# EasyEDA Pro project ProProject_my_heart_2023-08-05.epro

# Schematic Schematic1
Create Date: 2023-07-27; Page Name: P1; Project Name: my_heart; Schematic Name: Schematic1; Update Date: 2023-07-29; Company: 嘉立创EDA; Page Size: A3; Version: V1.0
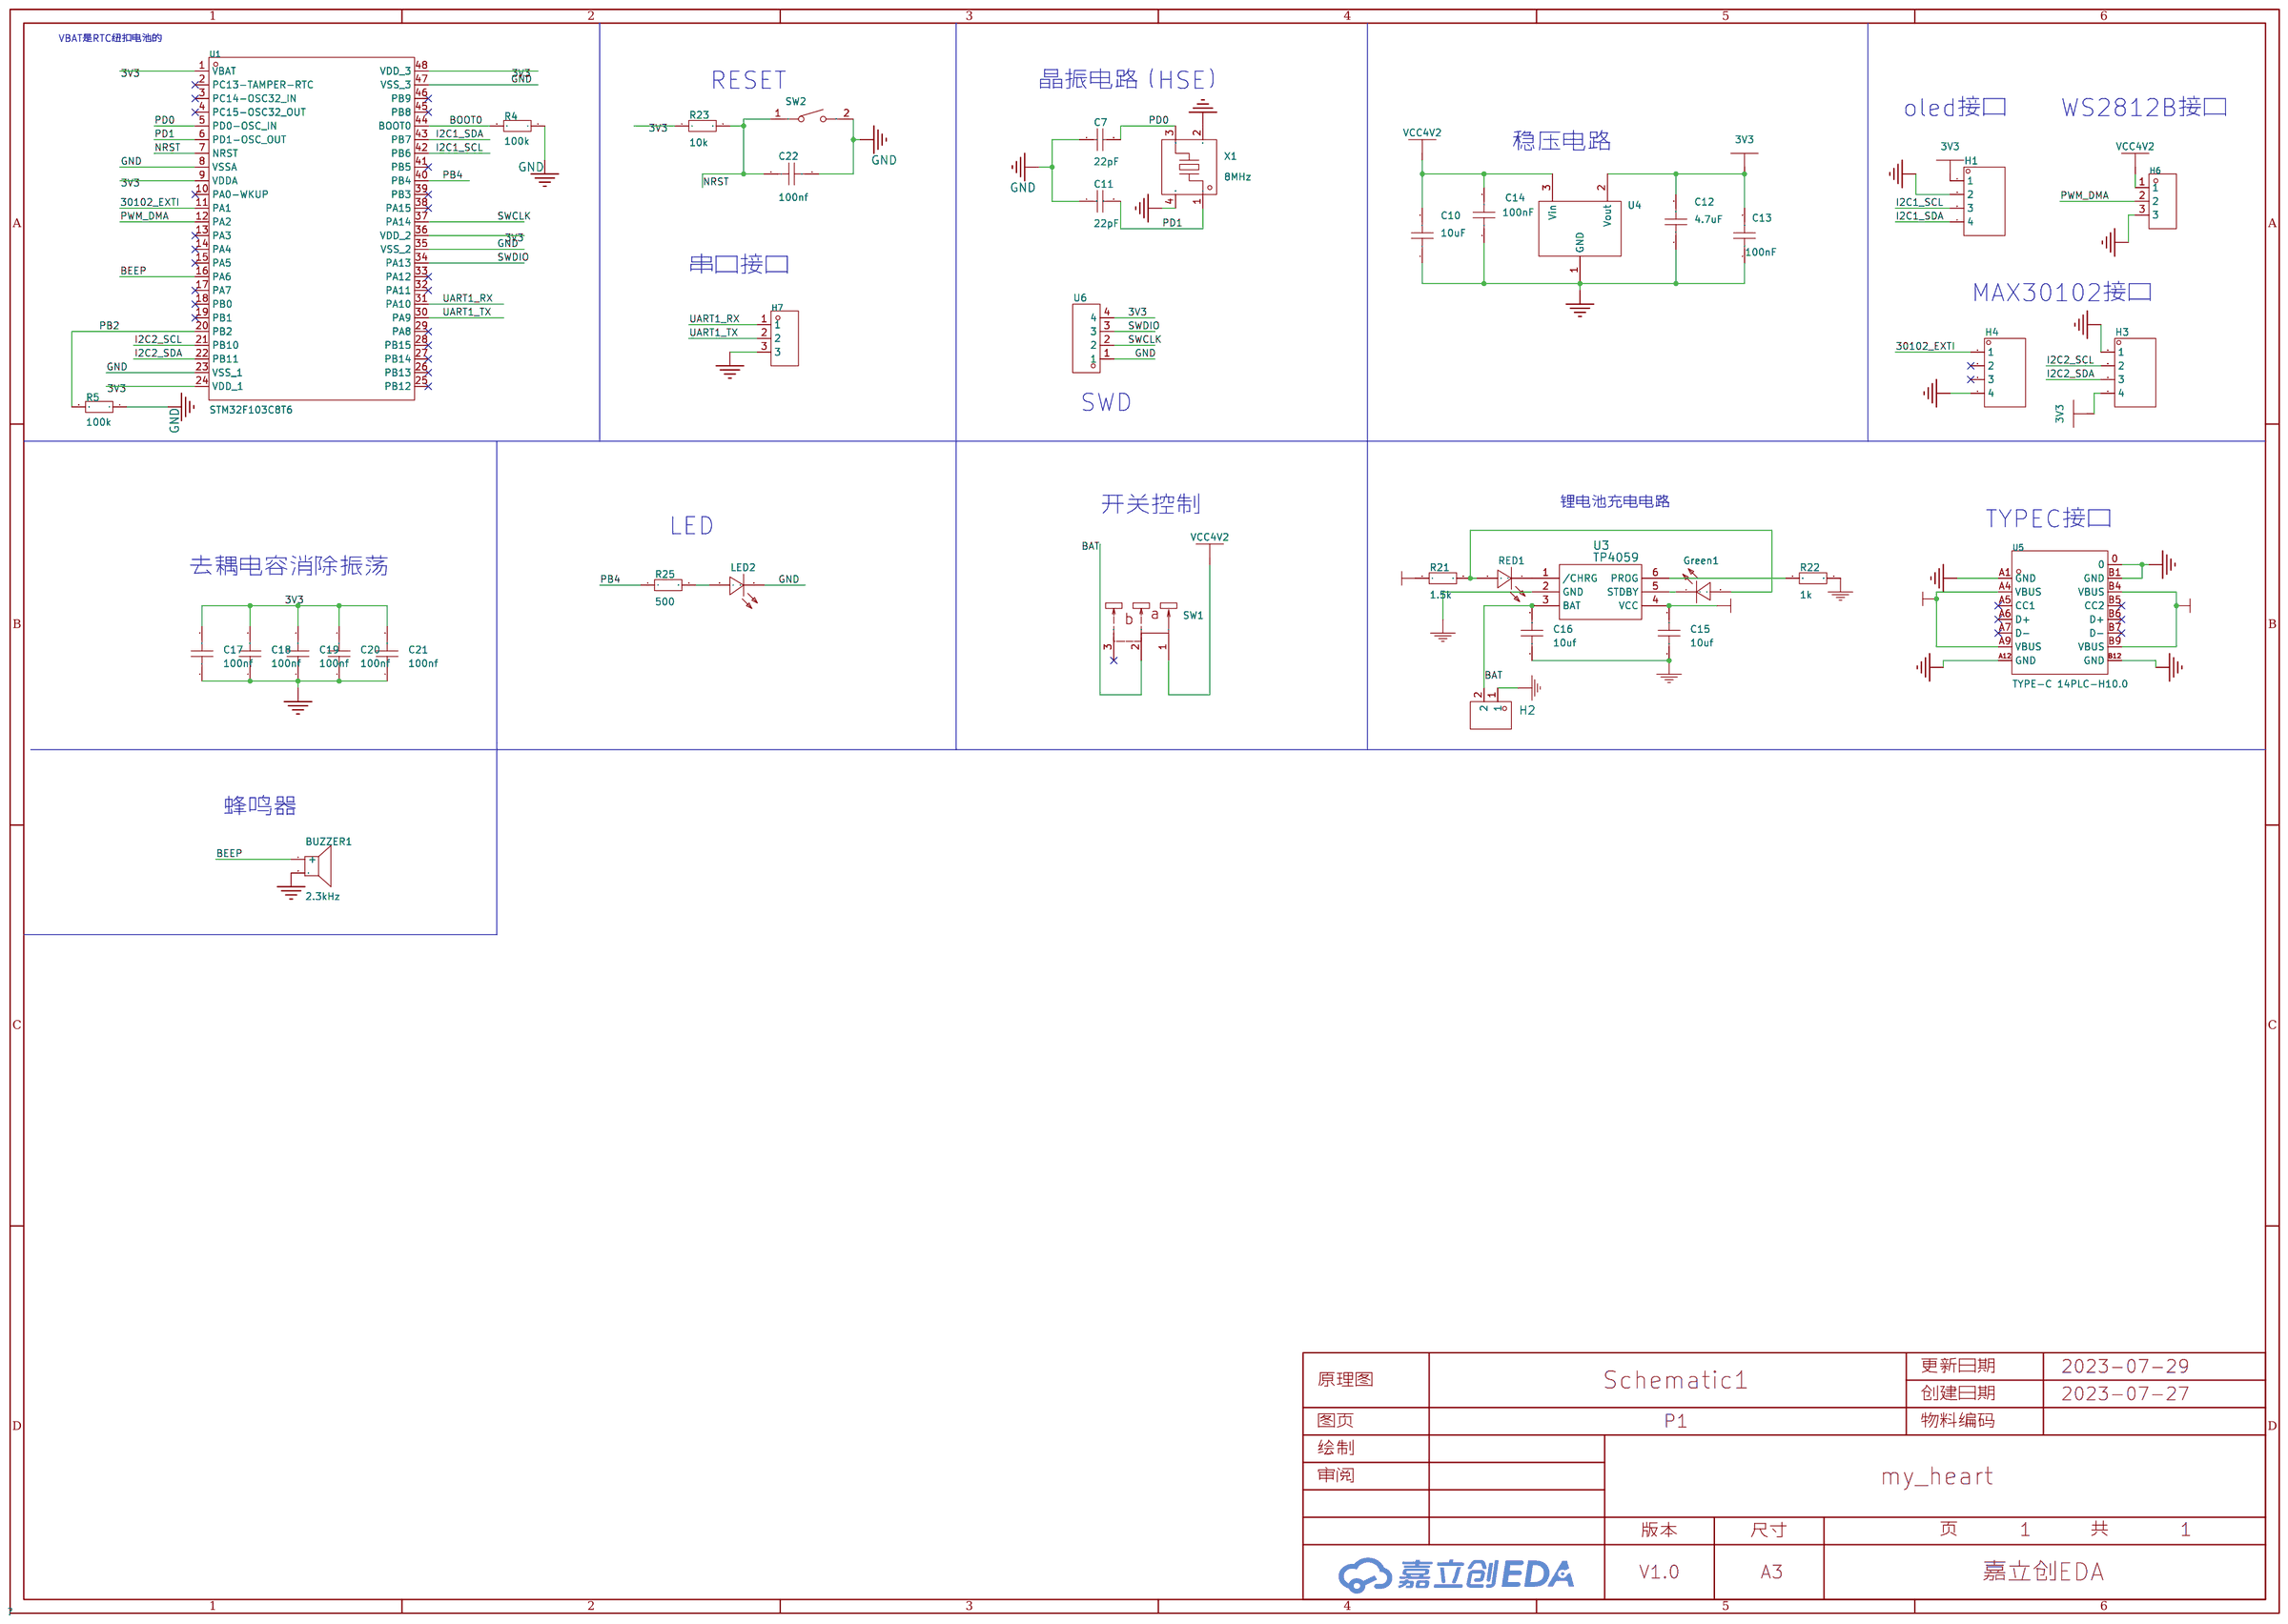
[diagram p0: schematic sheet]

## Parts
BUZZER1  2.3kHz  [BUZ-TH_BD12.0-P7.60-D0.6-FD]
C7  22pF  [C0805]
C10  10uF  [c0805]
C11  22pF  [C0805]
C12  4.7uF  [c0805]
C13  100nF  [c0805]
C14  100nF  [c0805]
C15  100nF  [C0603]
C16  100nF  [C0603]
C17  100nF  [C0603]
C18  100nF  [C0603]
C19  100nF  [C0603]
C20  100nF  [C0603]
C21  100nF  [C0603]
C22  100nF  [C0603]
Green1  KT-0603R  [LED0603-RD]
H1  -  [HDR-TH_4P-P2.54-V-M_1]
H2  MF254V-11-02-0743  [HDR-TH_2P-P2.00-V-M]
H3  -  [HDR-TH_4P-P2.54-V-M_1]
H4  -  [HDR-TH_4P-P2.54-V-M_1]
H6  -  [HDR-TH_3P-P2.54-V-F]
H7  -  [HDR-TH_3P-P2.54-V-F]
LED2  KT-0603R  [LED0603-RD]
R4  100k  [r0805]
R5  100k  [r0805]
R21  10K  [R0603]
R22  10K  [R0603]
R23  10K  [R0603]
R25  10K  [R0603]
RED1  KT-0603R  [LED0603-RD]
SW1  -  [SW-TH_K3-1260D-K1]
SW2  TS-1088-AR02016  [SW-SMD_L3.9-W3.0-P4.45]
U1  STM32F103C8T6  [LQFP-48_L7.0-W7.0-P0.50-LS9.0-BL]
U3  TP4059  [SOT-23-6_L2.9-W1.6-P0.95-LS2.8-BR]
U4  -  [SOT-89-3_L4.5-W2.5-P1.50-LS4.2-BR]
U5  TYPE-C 14PLC-H10.0  [USB-C-TH_SHOUHAN_TYPE-C-14PLC-H10.0]
U6  -  [HDR-TH_4P-P2.54-V-M-3]
X1  8MHz  [OSC-SMD_4P-L3.2-W2.5-BL]

## Library data of the parts
BUZZER1 = TMB12A05_C96093: 驱动方式:有源(内含驱动线路);构造类型:电磁式;额定电压:5V;频率:2.3kHz;声压(SPL):85dB@5V,10cm;; LCSC Part Name: TMB12A05; Supplier Part: C96093; Manufacturer: 华能; Manufacturer Part: TMB12A05; Supplier Footprint: 插件,D=12mm; JLCPCB Part Class: 扩展库; Datasheet: https://atta.szlcsc.com/upload/public/pdf/source/20170522/1495448324811.pdf; Supplier: LCSC; Oscillator Circuit: 有源(内含驱动线路); Technology Type: 电磁式; Rated Voltage: 5V; Operating Voltage: 4V~8V; Sound Pressure Level (SPL): 85dB@5V,10cm; Diameter (φD): 12mm; Height: 9.8mm
C7 C11 = CC0805JRNPO9BN220: 容值:22pF;精度:±5%;额定电压:50V;温度系数:NP0;; LCSC Part Name: 22pF ±5% 50V; Supplier Part: C105623; Manufacturer: YAGEO(国巨); Supplier Footprint: 0805; JLCPCB Part Class: Extended Part; Datasheet: https://atta.szlcsc.com/upload/public/pdf/source/20170425/1493115772948.pdf; Supplier: LCSC; Tolerance: ±5%; Voltage Rated: 50V; Temperature Coefficient: NP0
C10 = CL21B106KOQNNNE: 容值:10uF;精度:±10%;额定电压:16V;温度系数:X7R;; LCSC Part Name: 10uF ±10% 16V; Supplier Part: C95841; Manufacturer: SAMSUNG(三星); Supplier Footprint: 0805; JLCPCB Part Class: Extended Part; Datasheet: https://atta.szlcsc.com/upload/public/pdf/source/20170228/1488267683307.pdf; Supplier: LCSC; Tolerance: ±10%; Voltage Rated: 16V; Temperature Coefficient: X7R
C12 = CC0805KKX5R8BB475: 容值:4.7uF;精度:±10%;额定电压:25V;温度系数:X5R;; LCSC Part Name: 4.7uF ±10% 25V; Supplier Part: C132173; Manufacturer: YAGEO(国巨); Supplier Footprint: 0805; JLCPCB Part Class: Extended Part; Datasheet: https://atta.szlcsc.com/upload/public/pdf/source/20180820/C132173_6FEE718E05F4F70062189A38690F3008.pdf; Supplier: LCSC; Tolerance: ±10%; Voltage Rated: 25V; Temperature Coefficient: X5R
C13 C14 = TCC0805X7R104K250DTS: 容值:100nF;精度:±10%;额定电压:25V;温度系数:X7R;; LCSC Part Name: 100nF ±10% 25V; Supplier Part: C376923; Manufacturer: CCTC(三环); Supplier Footprint: 0805; JLCPCB Part Class: Extended Part; Datasheet: https://atta.szlcsc.com/upload/public/pdf/source/20190418/C376923_132AE681988A7150F2DFEA56798C5038.pdf; Supplier: LCSC; Tolerance: ±10%; Voltage Rated: 25V; Temperature Coefficient: X7R
C15-C22 = CAP_0603: Supplier Footprint: 0603
Green1 LED2 RED1 = KT-0603R: 发光颜色:红灯;二极管配置:-;透镜颜色:-;主波长:-;色温:-;功率:-;发光角度:-;安装方式:-;工作温度:-40℃~+85℃;; LCSC Part Name: 0603 红灯 高亮; Supplier Part: C2286; Manufacturer: KENTO; Supplier Footprint: 0603; JLCPCB Part Class: 基础库; Datasheet: https://atta.szlcsc.com/upload/public/pdf/source/20160616/1466072038404.pdf; Supplier: LCSC; Emitted Color: 红灯; Operating Temperature: -40℃~+85℃
H1 H3 H4 = B-2100S04P-A110: 间距:2.54mm;总PIN位数:4;排数:1;插针结构:1x4P;行距:-;安装类型:直插;圆针/方针:-;额定电流:-;额定电压:-;配合针长度:6mm;塑高:2.54mm;端接针长度:3mm;触头材质:黄铜;触头镀层:-;工作温度范围:-40~+105;颜色:黑色;; LCSC Part Name: 2.54mm 1x4P; Supplier Part: C124378; Manufacturer: Ckmtw(灿科盟); Supplier Footprint: 插件,P=2.54mm; JLCPCB Part Class: Extended Part; Datasheet: https://atta.szlcsc.com/upload/public/pdf/source/20170821/C124378_1503303307508901532.pdf; Supplier: LCSC; Pitch: 2.54mm; Number of Pins: 4; Number of Rows: 1; Pin Structure: 1x4P; Mounting Type: 直插; Length of Mating Pin: 6mm; Insulation Height: 2.54mm; Length of End Connection Pin: 3mm; Contact Material: 黄铜; Operating Temperature Range: -40~+105; Color: 黑色
H2 = MF254V-11-02-0743: Supplier: LCSC; Supplier Part: C2889984; Manufacturer: XFCN(台湾兴飞)
H6 H7 = HDR-F_2.54_1x3P: Supplier Part: C541850; Supplier Footprint: 插件
R4 R5 = RC-01W1002FT: 阻值:10k;精度:±1%;功率:50mW;温度系数:±200ppm/;最大工作电压:25V;工作温度范围:-55~+125;; LCSC Part Name: 10k ±1%; Supplier Part: C304501; Manufacturer: FH(风华); Supplier Footprint: 0201; JLCPCB Part Class: Extended Part; Datasheet: https://atta.szlcsc.com/upload/public/pdf/source/20181030/C304501_FF38550671994E5E8FB5233A4E4A9820.pdf; Supplier: LCSC; Tolerance: ±1%; Power(Watts): 50mW; Temperature Coefficient: ±200ppm/; Overload Voltage (Max): 25V; Operating Temperature Range: -55~+125
R21-R23 R25 = Res_0603: Supplier Footprint: 0603
SW1 = K3-1260D-K1: 额定电流(DC):300mA;额定电压(DC):6V;额定电流(AC):-;额定电压(AC):-;电路结构:单刀双掷;安装方式:卧插;机械寿命:10000;开关颜色:黑色;滑钮形状:矩形柱状;引脚样式:PC引脚;工作温度:-25~+80;开关长度:9mm;开关宽度:3.5mm;开关高度:3.5mm;; Supplier Part: C223844; Manufacturer: 韩国韩荣; Supplier Footprint: 插件; JLCPCB Part Class: Extended Part; Datasheet: https://atta.szlcsc.com/upload/public/pdf/source/20210810/7351E43B93A35FB9B10B4EA1B1334DD2.pdf; Supplier: LCSC; Current Rating (DC): 300mA; Voltage Rating (DC): 6V; Circuit: 单刀双掷; Mounting Style: 卧插; Mechanical Life: 10000; Actuator Color: 黑色; Actuator Style: 矩形柱状; Pin Style: PC引脚; Operating Temperature: -25~+80; Switch Length: 9mm; Switch Width: 3.5mm; Switch Height: 3.5mm
SW2 = TS-1088-AR02016: 触点电流:50mA;额定电压(DC):12V;绝缘电阻:100MΩ;电路结构:单刀单掷;安装方式:立贴;作用力:160gf@±50gf;机械寿命:10万次;带支架:否;; LCSC Part Name: 4*3*2mm 立贴 轻触开关; Supplier Part: C720477; Manufacturer: XUNPU(讯普); Supplier Footprint: SMD; JLCPCB Part Class: 扩展库; Datasheet: https://atta.szlcsc.com/upload/public/pdf/source/20200810/C720475_60D09DD6C54279ADDB2DC25100F1CC11.pdf; Supplier: LCSC; Contact Current: 50mA; Voltage Rating (DC): 12V; Insulation Resistance: 100MΩ; Circuit: 单刀单掷; Mounting Style: 立贴; Actuator Style: 圆形按钮; Actuator/Cap Color: 黑色; Operating Force: 160gf@±50gf; Mechanical Life: 10万次; Operating Temperature: -30℃~+80℃; Pin Style: SMD接片; Switch Length: 4mm; Switch Width: 3mm; Switch Height: 2mm; Strike Gundam: 否
U1 = STM32F103C8T6: CPU内核:ARM Cortex-M3;CPU最大主频:72MHz;工作电压范围:2V~3.6V;内部振荡器:有;程序 FLASH容量:64K@x8bit;RAM总容量:20KB;EEPROM/数据 FLASH容量:-;GPIO端口数量:37;ADC(单元数/通道数/位数):1@x10ch/12bit;外设/功能/协议栈:看门狗；DMA；看门狗；片载温度传感器;工作温度范围:-40℃~+85℃;; LCSC Part Name: ARM Cortex-M3 72MHz 闪存：64K@x8bit RAM：20KB MSL=3; Supplier Part: C8734; Manufacturer: ST(意法半导体); Supplier Footprint: LQFP-48(7x7); JLCPCB Part Class: 基础库; Supplier: LCSC; CPU Core: ARM Cortex-M3; Maximum Frequency: 72MHz; Supply Voltage Range: 2V~3.6V; Internal Oscillator: 有; Program FLASH Size: 64K@x8bit; RAM Size: 20KB; GPIO Ports Number: 37; ADC (Units/Channels/bits): 1@x10ch/12bit; Peripherals / Functions / Protocol Stacks: 看门狗；DMA；看门狗；片载温度传感器; Operating Temperature Range: -40℃~+85℃
U3 = TP4059: Supplier: LCSC; Manufacturer: TOPPOWER; Supplier Part: C80364; JLCPCB Part Class: Extended Part
U4 = CJA1117B-3.3: 输出类型:固定;输出极性:正;输出通道数:1;最大输入电压:15V;输出电压:3.3V;压差:1.3V@(1A);输出电流:1A;电源纹波抑制比(PRSS):75dB@(120Hz);; LCSC Part Name: Vin=15V Vout=3.3V 1A 75dB@(120Hz); Supplier Part: C24253; Manufacturer: CJ（江苏长电/长晶）; Supplier Footprint: SOT-89(SOT-89-3); JLCPCB Part Class: Extended Part; Datasheet: https://atta.szlcsc.com/upload/public/pdf/source/20180420/C24253_F213F71107BF9C399B1291ED7BD22659.pdf; Supplier: LCSC; Output Type: 固定; Output Polarity: 正; Number of Outputs: 1; Maximum Input Voltage: 15V; Output Voltage: 3.3V; Dropout Voltage: 1.3V@(1A); Output Current: 1A; Power Supply Rejection Ratio (PRSS): 75dB@(120Hz)
U5 = TYPE-C 14PLC-H10.0: 连接器类型:Type-C;标准:-;公母:母座;触点数量:14P;端口数量:1;安装方式:立插;额定电流 - 电源:5A;触头材质:-;触头镀层:-;工作温度范围:-40℃~+85℃;; LCSC Part Name: Type-C 母座 立插; Supplier Part: C3151746; Manufacturer: SHOU HAN(首韩); Supplier Footprint: 插件; JLCPCB Part Class: 扩展库; Datasheet: https://atta.szlcsc.com/upload/public/pdf/source/20220627/CFB3153B5198106DD3F3B6B367CF40F3.pdf; Supplier: LCSC; Connector Type: Type-C; Gender: 母座; Number of Contacts: 14P; Number of Ports: 1; Mounting Style: 立插; Current Rating - Power (Max): 5A; Operating Temperature Range: -40℃~+85℃
U6 = SIP4: Supplier Part: C9900010184; Supplier Footprint: HDR-TH_4P-P2.54; JLCPCB Part Class: Extended Part; Datasheet: https://atta.szlcsc.comnull; Supplier: LCSC
X1 = X32258MOB4SI: 频率:8MHz;频率公差:±10ppm;负载电容:12pF;; LCSC Part Name: 8MHz ±10ppm 12pF YSX321SL; Supplier Part: C2682775; Manufacturer: YXC(扬兴晶振); Supplier Footprint: SMD3225-4P; JLCPCB Part Class: Extended Part; Datasheet: https://atta.szlcsc.com/upload/public/pdf/source/20210106/C2682774_0CD4FDA5D9DA3FBEEC23BD607A48E4B0.pdf; Supplier: LCSC; Crystal Type: 贴片无源晶振; Frequency Tolerance: ±10ppm; Frequency Stability: ±30ppm; Load Capacitance: 12pF; Equivalent Series Resistance (ESR): 150Ω; Operating Temperature: -40℃~+85℃

## Nets
3V3: C12.2 C13.2 C17.2 C18.2 C19.2 C20.2 C21.2 H1.1 H3.4 R23.1 U1.1(VBAT) U1.9(VDDA) U1.24(VDD_1) U1.36(VDD_2) U1.48(VDD_3) U4.2(Vout) U6.4
GND: BUZZER1.2 C7.1 C10.1 C11.1 C12.1 C13.1 C14.1 C15.1 C16.1 C17.1 C18.1 C19.1 C20.1 C21.1 C22.1 H1.2 H2.1 H3.1 H4.4 H6.3 H7.3 LED2.1(K) R4.1 R5.1 R22.2 SW2.2 U1.8(VSSA) U1.23(VSS_1) U1.35(VSS_2) U1.47(VSS_3) U3.2(GND) U4.1(GND) U5.0 U5.A1(GND) U5.A12(GND) U5.B1(GND) U5.B12(GND) U6.1 X1.2(GND) X1.4(GND)
VCC4V2: C10.2 C14.2 H6.1 SW1.1 U4.3(Vin)
VCC5V: C15.2 R21.1 U3.4(VCC) U5.A4(VBUS) U5.A9(VBUS) U5.B4(VBUS) U5.B9(VBUS)
30102_EXTI: H4.1 U1.11(PA1)
BAT: C16.2 H2.2 SW1.2 U3.3(BAT)
BEEP: BUZZER1.1(+) U1.16(PA6)
BOOT0: R4.2 U1.44(BOOT0)
I2C1_SCL: H1.3 U1.42(PB6)
I2C1_SDA: H1.4 U1.43(PB7)
I2C2_SCL: H3.2 U1.21(PB10)
I2C2_SDA: H3.3 U1.22(PB11)
NRST: C22.2 R23.2 SW2.1 U1.7(NRST)
PB2: R5.2 U1.20(PB2)
PB4: R25.1 U1.40(PB4)
PD0: C7.2 U1.5(PD0-OSC_IN) X1.3
PD1: C11.2 U1.6(PD1-OSC_OUT) X1.1
PWM_DMA: H6.2 U1.12(PA2)
SWCLK: U1.37(PA14) U6.2
SWDIO: U1.34(PA13) U6.3
UART1_RX: H7.1 U1.31(PA10)
UART1_TX: H7.2 U1.30(PA9)
$1N1895: R22.1 U3.6(PROG)
$1N1898: Green1.1(K) U3.5(STDBY)
$1N1899: Green1.2(A) R21.2 RED1.2(A)
$1N5178: LED2.2(A) R25.2
$1N7040: RED1.1(K) U3.1(/CHRG)

Not connected (* = marked no-connect by the designer): H4 2* 3*; SW1 3*; U1 2(PC13-TAMPER-RTC)* 3(PC14-OSC32_IN)* 4(PC15-OSC32_OUT)* 10(PA0-WKUP)* 13(PA3)* 14(PA4)* 15(PA5)* 17(PA7)* 18(PB0)* 19(PB1)* 25(PB12)* 26(PB13)* 27(PB14)* 28(PB15)* 29(PA8)* 32(PA11)* 33(PA12)* 38(PA15)* 39(PB3)* 41(PB5)* 45(PB8)* 46(PB9)*; U5 A5(CC1)* A6(D+)* A7(D-)* B5(CC2)* B6(D+)* B7(D-)*

## Notes on the sheet
- VBAT是RTC纽扣电池的
- RESET
- 晶振电路（HSE）
- oled接口
- WS2812B接口
- 稳压电路
- 串口接口
- MAX30102接口
- SWD
- 开关控制
- 锂电池充电电路
- TYPEC接口
- LED
- 去耦电容消除振荡
- 蜂鸣器

# Board PCB1
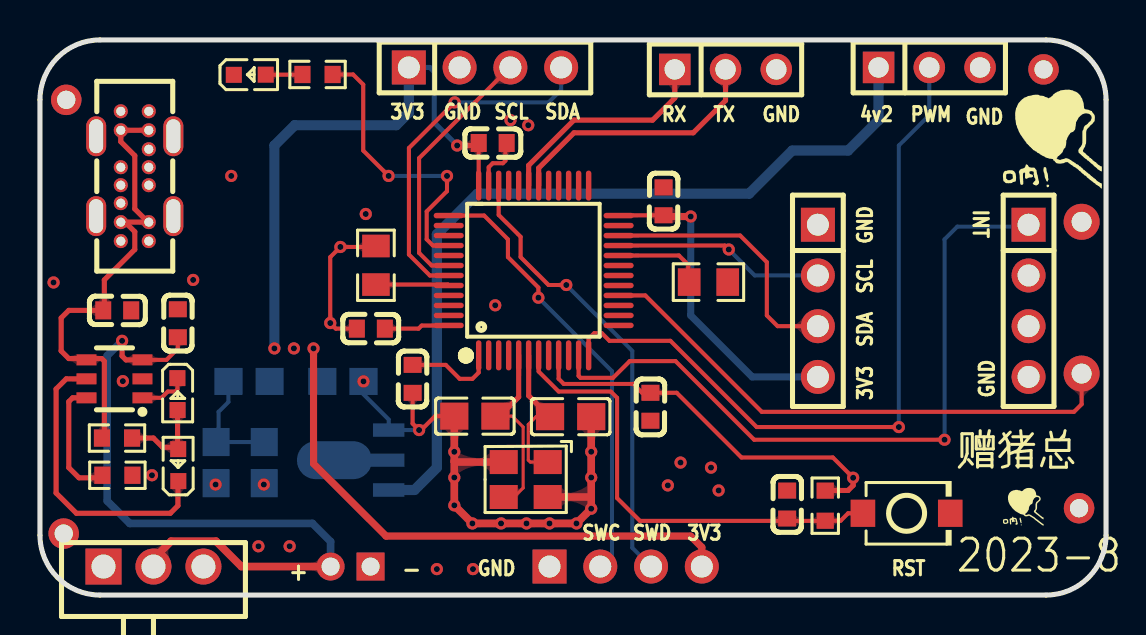
[diagram p1: board, top side]
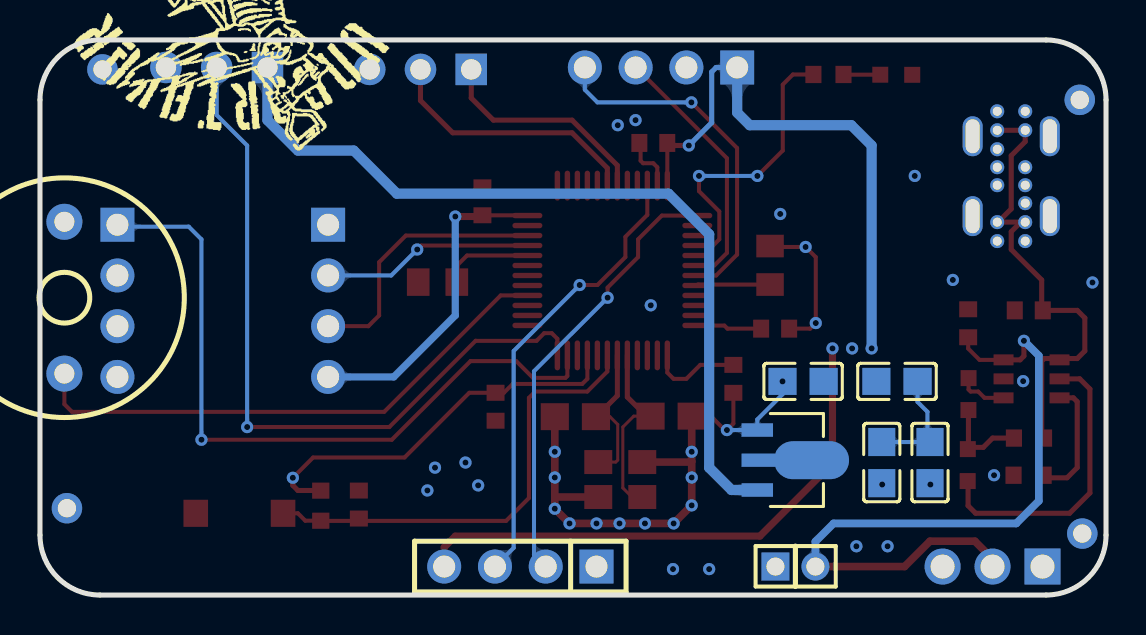
[diagram p2: board, bottom side, seen from below]

Outline 53.34 x 27.79 mm; copper layers: Top Layer, Bottom Layer. Coordinates in mm from the lower left corner of the outline.
Outline path: 0,24.79 arc(0.88,26.92) 3,27.79 50.34,27.79 arc(52.46,26.92) 53.34,24.79 53.34,3 arc(52.46,0.88) 50.34,0 3,0 arc(0.88,0.88) 0,3 0,24.79
Stack: Top Layer 0.035mm - / Dielectric1 1.51mm FR4 er 4.5 / Bottom Layer 0.035mm -

## Design rules (mm)
template: 自定义配置
spacing copperThickness1oz (default): track to track 0.102, other pairs 0.152 to 0.3
spacing copperThickness2oz: track to track 0.203, other pairs 0.152 to 0.3
track width copperThickness1oz (default): min 0.127, default 0.254, max 2.54
track width copperThickness2oz: min 0.203, default 0.254, max 2.54
differential pair differentialPair (default): width min 0.127, default 0.254, max 2.54; gap min 0.152, default 0.152
via viaSize (default): diameter min 0.5, default 0.61, max 10; hole min 0.3, default 0.305, max 6.3

## Placement (name value [footprint] x y rotation side)
BUZZER1  2.3kHz  [BUZ-TH_BD12.0-P7.60-D0.6-FD]  52.11 14.89 90 bottom
C7  22pF  [C0805]  21.76 8.96 0 top
C10  10uF  [c0805]  8.81 6.63 270 bottom
C11  22pF  [C0805]  26.55 8.93 180 top
C12  4.7uF  [c0805]  10.46 10.7 0 bottom
C13  100nF  [c0805]  15.16 10.7 180 bottom
C14  100nF  [c0805]  11.22 6.63 270 bottom
C15  100nF  [C0603]  3.87 14.25 180 top
C16  100nF  [C0603]  6.9 13.61 270 top
C17  100nF  [C0603]  30.54 9.43 90 top
C18  100nF  [C0603]  16.55 13.34 0 top
C19  100nF  [C0603]  18.64 10.83 90 top
C20  100nF  [C0603]  31.2 19.72 270 top
C21  100nF  [C0603]  22.65 22.64 180 top
C22  100nF  [C0603]  37.38 4.53 270 top
Green1  KT-0603R  [LED0603-RD]  6.92 6.51 90 top
H1  -  [HDR-TH_4P-P2.54-V-M_1]  22.26 26.42 0 top
H2  MF254V-11-02-0743  [HDR-TH_2P-P2.00-V-M]  15.54 1.43 180 bottom
H3  -  [HDR-TH_4P-P2.54-V-M_1]  38.92 14.73 270 top
H4  -  [HDR-TH_4P-P2.54-V-M_1]  49.46 14.73 270 top
H6  -  [HDR-TH_3P-P2.54-V-F]  44.49 26.42 0 top
H7  -  [HDR-TH_3P-P2.54-V-F]  34.3 26.32 0 top
LED2  KT-0603R  [LED0603-RD]  10.5 26.05 0 top
NOREF  -  [Pad_e117]  1.31 24.8 0 top
NOREF#2  -  [Pad_e124]  51.99 4.35 0 top
NOREF#3  -  [Pad_e133]  1.19 3.08 0 top
NOREF#4  -  [Pad_e123]  50.21 26.32 0 top
R4  100k  [r0805]  16.81 16.51 270 top
R5  100k  [r0805]  33.44 15.67 180 top
R21  10K  [R0603]  3.85 7.86 0 top
R22  10K  [R0603]  3.87 6 0 top
R23  10K  [R0603]  39.29 4.48 270 top
R25  10K  [R0603]  13.89 26.06 180 top
RED1  KT-0603R  [LED0603-RD]  6.88 10.06 270 top
SW1  -  [SW-TH_K3-1260D-K1]  5.68 1.43 90 top
SW2  TS-1088-AR02016  [SW-SMD_L3.9-W3.0-P4.45]  43.36 4.09 0 top
U1  STM32F103C8T6  [LQFP-48_L7.0-W7.0-P0.50-LS9.0-BL]  24.7 16.25 0 top
U3  TP4059  [SOT-23-6_L2.9-W1.6-P0.95-LS2.8-BR]  3.73 10.83 0 top
U4  -  [SOT-89-3_L4.5-W2.5-P1.50-LS4.2-BR]  16.09 6.76 0 bottom
U5  TYPE-C 14PLC-H10.0  [USB-C-TH_SHOUHAN_TYPE-C-14PLC-H10.0]  4.74 20.97 90 top
U6  -  [HDR-TH_4P-P2.54-V-M-3]  29.3 1.43 0 bottom
X1  8MHz  [OSC-SMD_4P-L3.2-W2.5-BL]  24.3 5.78 180 top

## Footprints (pads in the part's own frame, mm; a bottom-side part is the same pattern mirrored in y, then rotated)
BUZ-TH_BD12.0-P7.60-D0.6-FD
  round 1.8 hole 1: 1(-3.8,0) 2(3.8,0)
C0603
  rect 0.8x0.9 smd: 1(-0.7,0) 2(0.7,0)
C0805
  rect 1.409x1.351 smd: 1(-1.028,0) 2(1.031,0)
c0805
  rect 1.409x1.351 smd: 1(-1.028,0) 2(1.031,0)
HDR-TH_2P-P2.00-V-M
  rect 1.4x1.4 hole 0.9: 1(-1,0)
  round 1.4 hole 0.9: 2(1,0)
HDR-TH_3P-P2.54-V-F
  rect 1.575x1.575 hole 1.02: 1(-2.54,0)
  round 1.575 hole 1.02: 2(0,0) 3(2.54,0)
HDR-TH_4P-P2.54-V-M-3
  rect 1.7x1.7 hole 1.1: 1(-3.81,0)
  round 1.7 hole 1.1: 2(-1.27,0) 3(1.27,0) 4(3.81,0)
HDR-TH_4P-P2.54-V-M_1
  rect 1.7x1.7 hole 1.1: 1(-3.81,0)
  round 1.7 hole 1.1: 2(-1.27,0) 3(1.27,0) 4(3.81,0)
LED0603-RD
  rect 0.8x0.8 smd: 1(-0.799,-0.004) 2(0.799,0.004)
LQFP-48_L7.0-W7.0-P0.50-LS9.0-BL
  oval 0.27x1.5 smd: 1(-2.75,-4.25) 2(-2.25,-4.25) 3(-1.75,-4.25) 4(-1.25,-4.25) 5(-0.75,-4.25) 6(-0.25,-4.25) 7(0.25,-4.25) 8(0.75,-4.25) 9(1.25,-4.25) 10(1.75,-4.25) 11(2.25,-4.25) 12(2.75,-4.25) 25(2.75,4.25) 26(2.25,4.25) 27(1.75,4.25) 28(1.25,4.25) 29(0.75,4.25) 30(0.25,4.25) 31(-0.25,4.25) 32(-0.75,4.25) 33(-1.25,4.25) 34(-1.75,4.25) 35(-2.25,4.25) 36(-2.75,4.25)
  oval 1.5x0.27 smd: 13(4.25,-2.75) 14(4.25,-2.25) 15(4.25,-1.75) 16(4.25,-1.25) 17(4.25,-0.75) 18(4.25,-0.25) 19(4.25,0.25) 20(4.25,0.75) 21(4.25,1.25) 22(4.25,1.75) 23(4.25,2.25) 24(4.25,2.75) 37(-4.25,2.75) 38(-4.25,2.25) 39(-4.25,1.75) 40(-4.25,1.25) 41(-4.25,0.75) 42(-4.25,0.25) 43(-4.25,-0.25) 44(-4.25,-0.75) 45(-4.25,-1.25) 46(-4.25,-1.75) 47(-4.25,-2.25) 48(-4.25,-2.75)
OSC-SMD_4P-L3.2-W2.5-BL
  rect 1.4x1.2 smd: 1(-1.1,-0.875) 2(1.1,-0.875) 3(1.1,0.875) 4(-1.1,0.875)
Pad_e117
  round 1.524 hole 0.914: 1(0,0)
Pad_e123
  round 1.524 hole 0.914: 3(0,0)
Pad_e124
  round 1.524 hole 0.914: 49(0,0)
Pad_e133
  round 1.524 hole 0.914: 50(0,0)
R0603
  rect 0.806x0.864 smd: 1(-0.753,0) 2(0.753,0)
r0805
  rect 1.133x1.377 smd: 1(-0.965,0) 2(0.965,0)
SOT-23-6_L2.9-W1.6-P0.95-LS2.8-BR
  rect 1x0.55 smd: 1(1.4,-0.95) 2(1.4,0) 3(1.4,0.95) 4(-1.4,0.95) 5(-1.4,0) 6(-1.4,-0.95)
SOT-89-3_L4.5-W2.5-P1.50-LS4.2-BR
  rect 1.575x0.673 smd: 1(1.357,-1.501) 3(1.357,1.501)
  custom 5.378x1.9 smd: 2(-1.357,0.007)
SW-SMD_L3.9-W3.0-P4.45
  rect 1.23x1.36 smd: 1(-2.185,0) 2(2.185,0)
SW-TH_K3-1260D-K1
  rect 1.801x1.801 hole 1.199: 1(0,2.499)
  round 1.801 hole 1.199: 2(0,0) 3(0,-2.499)
USB-C-TH_SHOUHAN_TYPE-C-14PLC-H10.0
  oval 2x1 hole 1.7x0.7: 0(-2,1.93) 0(-2,-1.93) 0(2,1.93) 0(2,-1.93)
  round 0.7 hole 0.45: A1(-3.25,0.7) A4(-2.3,0.7) A5(-1.35,0.7) A6(-0.45,0.7) A7(0.45,0.7) A9(2.3,0.7) A12(3.25,0.7) B1(3.25,-0.7) B4(2.3,-0.7) B5(1.35,-0.7) B6(0.45,-0.7) B7(-0.45,-0.7) B9(-2.3,-0.7) B12(-3.25,-0.7)

## Nets
As in the schematic.

Pads without a net: H4 2 3; NOREF 1; NOREF#2 49; NOREF#3 50; NOREF#4 3; SW1 3; U1 2 3 4 10 13 14 15 17 18 19 25 26 27 28 29 32 33 38 39 41 45 46; U5 A5 A6 A7 B5 B6 B7

## Via types
v1: diameter 0.61, hole 0.305, Top Layer to Bottom Layer, 49 vias

## Routing (per net, layer and track width the routed paths; a pad name or vN(x,y) marks a point on that pad's centre or on a via; arc(x,y) is an arc through that point)
3V3: length 100.4
  Top Layer w0.203: v1(40.68,5.87) 39.67,6.89 35.1,6.89 31.86,10.13 C17.2 30.12,10.13 29.68,10.57 26.21,10.57 25.95,10.83 U1.9 ; C19.2 20.3,11.53 21,10.83 21.63,10.83 21.95,11.14 U1.1 ; C18.2 18.94,13.34 19.09,13.49 20.44,13.49 U1.48 ; C20.2 28.96,19.02 U1.24 ; U1.36 C21.2
  Top Layer w0.254: C21.2 21.82,22.51 v1(20.87,22.51) ; v1(40.68,5.87) 40.68,5.49 40.43,5.24 39.3,5.24 R23.1
  Top Layer w0.355: v1(13.69,12.35) 13.69,6.58 17.32,2.95 32.56,2.95 33.11,2.39 U6.4 ; v1(32.56,18.95) 31.26,18.95 C20.2
  Bottom Layer w0.254: H1.1 19.5,26.42 19.73,26.19 19.73,23.65 v1(20.87,22.51)
  Bottom Layer w0.355: v1(32.56,18.95) 32.56,14 35.63,10.92 H3.4
  Bottom Layer w0.508: H1.1 18.45,24.16 17.82,23.53 12.74,23.53 11.73,22.51 v1(11.73,12.35)
  vias: v1(12.7,12.35)
GND: length 45.6
  Top Layer w0.203: R4.1 16.76,17.43 v1(15.03,17.43) 14.52,16.92 v1(14.52,13.62) 14.8,13.34 C18.1 ; C19.1 18.64,8.59 v1(18.97,8.26) 19.07,8.26 19.77,8.96 C7.1 ; U1.35 22.45,21.42 22.65,21.62 23.16,21.62 23.28,21.75 23.28,22.57 C21.1
  Top Layer w0.381: 23.2,6.66 20.75,6.66 20.73,6.68 ; 20.73,6.68 v1(20.73,5.89) v1(20.73,4.49) v1(21.63,3.59) v1(23.07,3.59) v1(24.34,3.59) v1(25.49,3.59) v1(26.84,3.59) v1(27.58,4.32) 27.58,4.93 ; 20.73,6.68 v1(20.73,7.17) C7.1 ; C11.1 v1(27.58,7.17) v1(27.58,5.89) 27.58,4.93 ; 27.58,4.93 27.56,4.91 X1.4
  Bottom Layer w0.203: v1(18.97,8.26) U4.1 17.45,8.79 16.19,10.05 v1(16.19,10.7) ; C12.1 9.43,9.67 8.93,9.17 8.93,7.79 C10.1 C14.1
  vias: v1(0.68,15.65) v1(4.15,10.71) v1(5.6,6) v1(7.66,15.78) v1(9.57,20.98) v1(10.93,2.44) v1(12.49,2.44) v1(16.3,19.08) v1(19.86,1.3) v1(21.66,1.3) v1(22.78,14.51) v1(23.54,23.78) v1(24.43,23.53) v1(31.41,5.49) v1(32.05,6.63) v1(33.57,6.38) v1(33.95,5.24)
VCC4V2: length 41.7
  Bottom Layer w0.508: 17.45,5.26 18.74,5.26 19.86,6.38 19.86,18.06 21.89,20.1 35.48,20.1 37.64,22.26 40.43,22.26 41.95,23.78 H6.1
  vias: v1(8.79,5.53) v1(11.2,5.53)
VCC5V: length 23.6
  Top Layer w0.152: U5.A4 4.04,18.54 ; 5.41,18.67 U5.B9
  Top Layer w0.254: 4.26,18.67 U5.A4 ; 4.26,18.67 4.74,18.19 4.74,17.3 3.22,15.78 3.22,14.31 C15.2 1.44,14.25 1.06,13.87 1.06,12.22 1.44,11.84 2.26,11.84 ; 4.26,18.67 5.41,18.67 4.74,19.33 4.74,22 4.04,22.7 U5.A9 U5.B4 ; 2.26,11.84 3.09,11.84 3.22,11.71 3.22,7.98 R21.1 ; 2.26,11.84 2.33,11.78
30102_EXTI: length 35.9
  Top Layer w0.203: v1(45.26,7.78) 35.73,7.78 31.79,11.71 29.51,11.71 28.67,10.88 27.04,10.88 26.95,10.97 U1.11
  Bottom Layer w0.203: H4.1 49.36,18.45 45.89,18.45 45.26,17.81 v1(45.26,7.78)
BAT: length 36.7
  Top Layer w0.203: C16.2 6.9,12.34 6.33,11.78 U3.3
  Top Layer w0.254: v1(4.11,12.73) 4.11,11.97 4.3,11.78 U3.3
  Top Layer w0.381: 5.04,1.17 6.56,2.7 8.81,2.7 10.08,1.43 H2.2
  Bottom Layer w0.381: v1(4.11,12.73) 3.36,11.98 3.36,4.71 4.49,3.59 13.63,3.59 14.54,2.68 H2.2
BEEP: length 27.3
  Top Layer w0.203: U1.16 30.28,15 36.11,9.17 51.73,9.17 52.11,9.56 BUZZER1.1
BOOT0: length 3.7
  Top Layer w0.203: R4.2 20.4,15.55 U1.44
I2C1_SCL: length 12.9
  Top Layer w0.203: H1.3 23.51,26.42 18.97,21.87 18.97,17.13 19.6,16.5 U1.42
I2C1_SDA: length 17.7
  Top Layer w0.203: v1(20.75,24.67) 18.46,22.38 18.46,17.05 19.51,16 U1.43
  Bottom Layer w0.203: v1(20.75,24.67) 25.44,24.67 26.07,25.3 H1.4
I2C2_SCL: length 10.6
  Top Layer w0.203: v1(34.46,17.3) 34.26,17.5 U1.21
  Bottom Layer w0.203: H3.2 35.76,16 v1(34.46,17.3)
I2C2_SDA: length 13.4
  Top Layer w0.203: H3.3 36.9,13.46 36.37,14 36.37,16.67 35.03,18 U1.22
NRST: length 23.1
  Top Layer w0.203: 39.16,3.71 30.02,3.71 28.87,4.86 28.87,9.87 28.56,10.19 25.95,10.19 24.95,11.19 U1.7 ; R23.2 40.06,3.72 40.43,4.09 SW2.1
PB2: length 4.5
  Top Layer w0.203: U1.20 31.97,17 32.43,16.54 32.43,15.67
PB4: length 14.6
  Top Layer w0.203: v1(20.36,20.98) 20.36,20.22 19.35,19.21 19.35,17.81 19.66,17.5 U1.40 ; R25.1 15.67,26.06 16.17,25.56 16.17,22.26 v1(17.44,20.98)
  Bottom Layer w0.203: v1(17.44,20.98) v1(20.36,20.98)
PD0: length 9.3
  Top Layer w0.152: 23.2,4.91 23.72,4.91 24.17,5.36 24.17,8.41 23.63,8.96 22.99,8.96
  Top Layer w0.254: U1.5 23.95,9.91 22.99,8.96 C7.2
PD1: length 7.6
  Top Layer w0.152: 25.52,8.93 24.82,8.93 24.43,8.54 24.43,6.76 24.53,6.66 X1.1
  Top Layer w0.254: U1.6 24.45,9.98 25.5,8.93
PWM_DMA: length 37
  Top Layer w0.203: U1.12 27.45,12.83 27.73,13.11 28.11,13.11 28.49,12.73 31.54,12.73 35.86,8.41 v1(42.97,8.41)
  Bottom Layer w0.203: v1(42.97,8.41) 42.97,22.51 44.49,24.03 H6.2
SWCLK: length 22.2
  Top Layer w0.203: v1(24.94,14.89) 24.94,15.4 23.41,16.92 23.41,17.81 22.22,19 U1.37
  Bottom Layer w0.203: U6.2 28.62,2.01 28.62,11.21 v1(24.94,14.89)
SWDIO: length 22.8
  Top Layer w0.203: v1(26.33,15.52) 25.44,15.52 24.05,16.92 24.05,17.94 22.95,19.03 U1.34
  Bottom Layer w0.203: U6.3 29.64,2.36 29.64,12.22 v1(26.33,15.52)
UART1_RX: length 11.2
  Top Layer w0.254: U1.31 24.45,21.51 26.71,23.78 30.65,23.78 31.76,24.89 H7.1
UART1_TX: length 13.2
  Top Layer w0.254: U1.30 24.95,21.38 26.72,23.14 32.68,23.14 34.3,24.76 H7.2
$1N1895: length 6.2
  Top Layer w0.254: 2.33,9.88 1.63,9.88 1.44,9.68 1.44,6.38 1.95,5.87 2.99,5.87 R22.1
$1N1898: length 14.9
  Top Layer w0.254: Green1.1 6.9,5.69 6.9,4.48 6.52,4.09 1.82,4.09 0.81,5.11 0.81,10.32 1.31,10.83 2.33,10.83
$1N1899: length 4.4
  Top Layer w0.254: 6.83,7.4 6.88,7.45 RED1.2 ; 6.83,7.4 6.92,7.31 ; 6.83,7.4 6.14,7.4 5.68,7.86 R21.2
$1N5178: length 1.8
  Top Layer w0.203: 11.3,26.05 13.12,26.05 R25.2
$1N7040: length 2.5
  Top Layer w0.203: RED1.1 6.88,10.29 6.78,10.19 6.39,10.19 6.08,9.88 U3.1

## Copper pours and planes (outline as drawn; the poured copper is in the pictures)
3V3 on Top Layer: 11.35,12.98 11.09,12.73 11.09,12.09 11.35,11.84 17.19,11.84 18.21,10.82 19.47,10.82 19.73,11.08 19.73,12.22 19.47,12.48 18.46,12.48 17.94,12.99 17.94,14.05 17.9,14.05 17.7,14.25 16.81,14.25 16.55,13.99 16.55,12.92 16.26,12.64 14.24,12.64 14.01,12.86 13.25,12.86 13.12,12.98
3V3 on Bottom Layer: 10.46,9.68 10.71,9.43 12.11,9.43 12.62,8.92 12.62,6.51 13.38,5.75 16.3,5.75 16.68,6.13 18.33,6.13 18.59,6.38 18.59,7.14 18.46,7.27 16.81,7.27 15.16,8.92 15.16,11.97 14.14,12.98 11.22,12.98 10.46,12.22
3V3 on Bottom Layer: 32.05,0.79 32.43,0.41 39.41,0.41 41.33,2.33 41.33,10.94 40.18,12.09 37.38,12.09 36.49,11.21 36.49,4.98 35.6,4.09 32.94,4.09 32.05,3.2
GND on Top Layer: -6.56,33.43 62.27,33.43 62.27,-7.08 -6.56,-7.08
GND on Bottom Layer: -9.23,37.24 66.34,37.24 66.34,-13.43 -9.23,-13.43
VCC4V2 on Top Layer: 8.15,6.76 7.79,6.41 7.79,4.38 7.13,3.71 2.89,3.71 1.95,2.77 1.95,0.54 2.2,0.28 3.85,0.28 4.24,0.67 4.24,2.7 4.62,3.08 11.86,3.08 12.24,3.46 12.24,6.51 11.98,6.76
VCC4V2 on Bottom Layer: 18.46,5.75 18.71,5.49 18.71,4.97 18.46,4.72 8.18,4.72 7.92,4.98 7.79,4.98 7.79,6.28 8.15,6.63 12.24,6.63 13.25,5.62 13.25,5.62 16.34,5.62 16.47,5.75

Small or netless copper shapes (teardrops, artwork), in the pictures only: 139 on Top Layer, 31 on Bottom Layer

## Text on the board
Top Silkscreen Layer: 3V3 | GND | SCL | SDA | 4v2 | RST | INT | SWC | SWD | RX | TX | PWM | + | - | 赠猪总 / 2023-8
